# Altium schematic sheet TEST-MODULE-V3.SchDoc
size A3
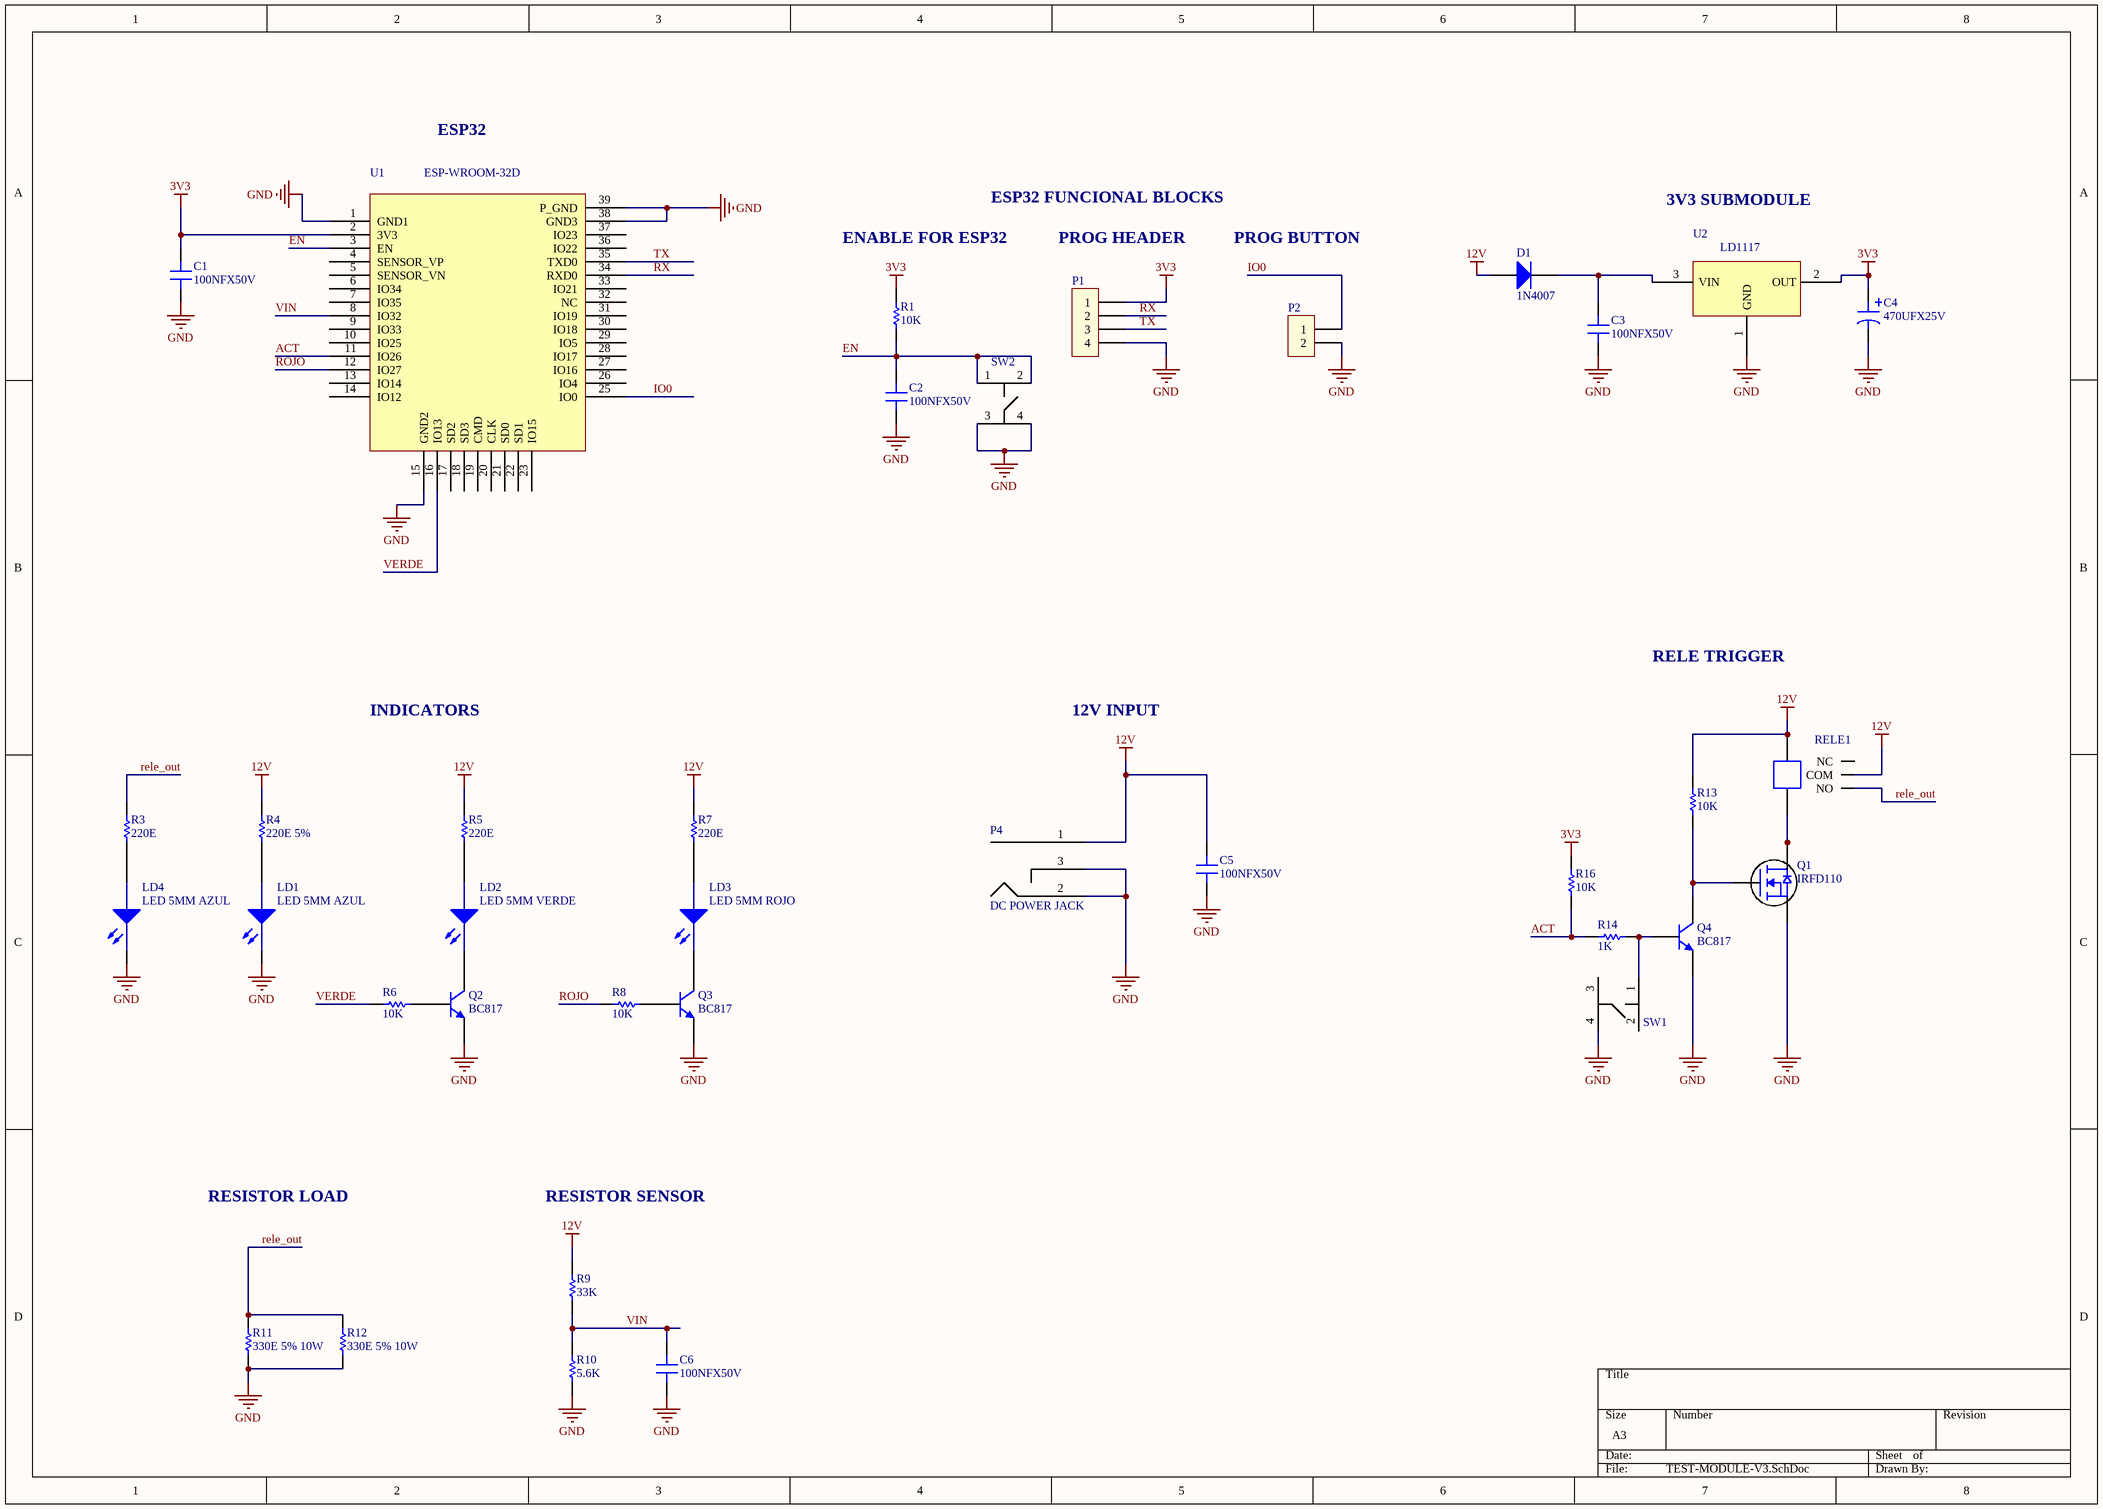
[diagram p0: TEST-MODULE-V3.SchDoc]

## Parts
C1  100NFX50V  [CAP.SMD.0805]
C2  100NFX50V  [CAP.SMD.0805]
C3  100NFX50V  [CAP.SMD.0805]
C4  470UFX25V  [CAP-ELEC-10X13]
C5  100NFX50V  [CAP.SMD.0805]
C6  100NFX50V  [CAP.SMD.0805]
D1  1N4007  [Diode DO41]
LD1  LED 5MM AZUL  [LED-5MM-ALTO-9-AZUL]
LD2  LED 5MM VERDE  [LED-5MM-ALTO-9-VERDE]
LD3  LED 5MM ROJO  [LED-5MM-ALTO-9-ROJO]
LD4  LED 5MM AZUL  [LED-5MM-ALTO-9-AZUL]
P1  IDC-HE-THT-1X4-P2.54MM  [IDC-HE-THT-1X4-P2.54MM]  (value not drawn)
P2  IDC-MA-THT-1X2-P2.54MM-L11  [IDC-MA-THT-1X2-P2.54MM-L11]  (value not drawn)
P4  DC POWER JACK  [VAR-DC-JACK - VERT]
Q1  IRFD110  [TRA-IRFD110]
Q2  BC817  [NPN.SMD.SOT23]
Q3  BC817  [NPN.SMD.SOT23]
Q4  BC817  [NPN.SMD.SOT23]
R1  10K  [RES.SMD.103]
R3  220E  [RES.SMD.221]
R4  220E 5%  [RES.SMD.221]
R5  220E  [RES.SMD.221]
R6  10K  [RES.SMD.103]
R7  220E  [RES.SMD.221]
R8  10K  [RES.SMD.103]
R9  33K  [RES.SMD.333]
R10  5.6K  [RES.SMD.562]
R11  330E 5% 10W  [RES-CERAMICA-10W]
R12  330E 5% 10W  [RES-CERAMICA-10W]
R13  10K  [RES.SMD.103]
R14  1K  [RES.SMD.102]
R16  10K  [RES.SMD.103]
RELE1  Relay simple inversor 12V 12A  [RELAY 12V 12A CHICO]  (value not drawn)
SW1  TACT-SWITCH-THT-4C-06X06(13MM)-JIANFU  [TACT-SWITCH-THT-4C-06X06-13MM]  (value not drawn)
SW2  TACT-SWITCH-THT-4C-06X06(5MM)  [TACT-SWITCH-THT-4C-06X06-5MM]  (value not drawn)
U1  ESP32-WROOM-32D  [ESP32-WROOM-32D]  (value not drawn)
U2  LD1117S33TR SMD DPAK 0.8A 3.3V LDO LINEAR REGULATOR  [DPAK]  (value not drawn)

## Nets
3V3: C1.2 C4.1 P1.1 R1.2 R16.2 U1.2(3V3) U2.2(OUT)
12V: C5.2 D1.A P4.1 R4.2 R5.2 R7.2 R9.2 R13.2 RELE1.1 RELE1.3(COM)
GND: C1.1 C2.1 C3.1 C4.2 C5.1 C6.1 LD1.K(KB) LD4.K(KB) P1.4 P2.2 P4.2 P4.3 Q1.4 Q2.2(E) Q3.2(E) Q4.2(E) R10.1 R11.1 R12.1 SW1.4 SW2.3 SW2.4 U1.1(GND1) U1.15(GND2) U1.38(GND3) U1.39(P_GND) U2.1(GND)
ACT: R14.1 R16.1 U1.11(IO26)
EN: C2.2 R1.1 SW2.1 SW2.2 U1.3(EN)
IO0: P2.1 U1.25(IO0)
rele_out: R3.2 R11.2 R12.2 RELE1.4(NO)
ROJO: R8.2 U1.12(IO27)
RX: P1.2 U1.34(RXD0)
TX: P1.3 U1.35(TXD0)
VERDE: R6.1 U1.16(IO13)
VIN: C6.2 R9.1 R10.2 U1.8(IO32)
NetC3_2: C3.2 D1.K U2.3(VIN)
NetLD1_A: LD1.A(AB) R4.1
NetLD2_A: LD2.A(AB) R5.1
NetLD2_K: LD2.K(KB) Q2.3(C)
NetLD3_A: LD3.A(AB) R7.1
NetLD3_K: LD3.K(KB) Q3.3(C)
NetLD4_A: LD4.A(AB) R3.1
NetQ1_1: Q1.1 Q1.2 RELE1.2
NetQ1_3: Q1.3 Q4.3(C) R13.1
NetQ2_1: Q2.1(B) R6.2
NetQ3_1: Q3.1(B) R8.1
NetQ4_1: Q4.1(B) R14.2 SW1.1

Not connected (* = marked no-connect by the designer): RELE1 5(NC); SW1 2 3; U1 4(SENSOR_VP) 5(SENSOR_VN) 6(IO34) 7(IO35) 9(IO33) 10(IO25) 13(IO14) 14(IO12) 17(SD2) 18(SD3) 19(CMD) 20(CLK) 21(SD0) 22(SD1) 23(IO15) 26(IO4) 27(IO16) 28(IO17) 29(IO5) 30(IO18) 31(IO19) 32(NC) 33(IO21) 36(IO22) 37(IO23)

## Notes on the sheet
- ESP32
- ENABLE FOR ESP32
- ESP32 FUNCIONAL BLOCKS
- PROG HEADER
- PROG BUTTON
- 3V3 SUBMODULE
- INDICATORS
- 12V INPUT
- RELE TRIGGER
- RESISTOR LOAD
- RESISTOR SENSOR
- (in symbol ESP32-WROOM-32D) ESP-WROOM-32D
- (in symbol LD1117S33TR SMD DPAK 0.8A 3.3V LDO LINEAR REGULATOR) LD1117

## Library data of the parts
C1-C3 C5 C6 = Capacitor 100NFX50V X7R 10% CER.MULT. SMD 0805: 100NFX50V X7R 10% CER.MULT. SMD 0805; COD. ELEMON: CA3279774; COD. FV: CE.CAP.0008
C4 = Capacitor Electrolitico 470UFX25V 85°C 10x13 ELE.RAD: 470UFX25V 85°C 10x13 ELE.RAD; COD. ELEMON: CA3609281A
D1 = Diodo 1N4007 DIODO 1A 1000V DO41: COD. ELEMON: DI1152060
LD1 LD4 = LED 5MM AZUL ALTO 9
LD2 = LED 5MM VERDE ALTO 9
LD3 = LED 5MM ROJO ALTO 9
P1 = IDC-HE-THT-1X4-P2.54MM: COD. ELEMON: CO5001085; COD. SYC: PB04S
P2 = IDC-MA-THT-1X2-P2.54MM-L11: COD. ELEMON: CO496C20
P4 = DC POWER JACK VERTICAL 2MM
Q1 = Transistor MOSFET N IRFD110: COD. FV: CE.TRA.0003
Q2-Q4 = Transistor BC817-40 TRA.NPN 45V0.5A 0.25W SOT23: BC817-40 TRA.NPN 45V0.5A 0.25W SOT23; COD. ELEMON: TR1723020; COD. FV: CE.TRA.0002
R1 R6 R8 R13 R16 = Resistencia 10K 5% 0805 1/8W: 10K 5% 0805 1/8W RES.SMD; COD. ELEMON: RS3896245; COD. FV: CE.RES.0014
R3-R5 R7 = Resistencia 220E 5% 0805 1/8W: 220E 5% 0805 1/8W RES.SMD; COD. ELEMON: RS3896145
R9 = Resistencia 33K 5% 0805 1/8W: 33K 5% 0805 1/8W RES.SMD; COD. ELEMON: RS3896275; COD. FV: CE.RES.0015
R10 = Resistencia 5.6K 5% 0805 1/8W: 5.6K 5% 0805 1/8W RES.SMD; COD. ELEMON: RS3896230
R11 R12 = Resistencia Ceramica 330E 5% 10W SE15 RES.CEM: COD. ELEMON: RS4096155
R14 = Resistencia 1K 5% 0805 1/8W: 1K 5% 0805 1/8W RES.SMD; COD. ELEMON: RS3896185; COD. FV: CE.RES.0012
RELE1 = VAR-RELE-12V Relay simple inversor chico 12V 12A
SW1 = TACT-SWITCH-THT-4C-06X06(13MM)-JIANFU: COD. ELEMON: SW5702124
SW2 = TACT-SWITCH-THT-4C-06X06(5MM): COD. ELEMON: SW5702101
U1 = ESP32-WROOM-32D: COD. ELEMON: RF9301435